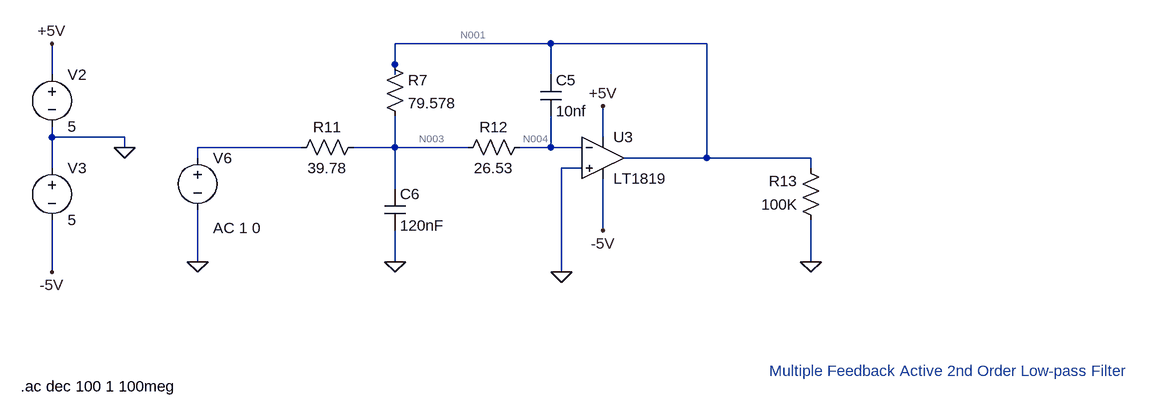
[diagram p0: schematic SecondOrder2.asc]
* SecondOrder2.asc
V2 +5V 0 5
V3 0 -5V 5
* U3: LT1819 (symbol Opamps\LT1819 not available, pins judged from their places): In+=0 In-=N004 V+=+5V V-=-5V OUT=N001
R7 N001 N003 79.578
R11 N003 N002 39.78
R12 N004 N003 26.53
R13 0 N001 100K
C5 N001 N004 10nf
C6 N003 0 120nF
V6 N002 0 AC 1 0
* Multiple Feedback Active 2nd Order Low-pass Filter
.ac dec 100 1 100meg
.backanno
.end

* Results of the author's LTspice run, read from the files saved beside the schematic
* Operating Point, zero values left out:
*   V(+5v) = 5 V
*   V(-5v) = -5 V
*   V(n004) = 3.039 µV
*   V(n001) = -309.2 µV
*   V(n003) = -50.01 µV
*   I(R13) = 3.092 nA
*   I(R12) = 2 µA
*   I(R11) = -1.257 µA
*   I(R7) = -3.257 µA
*   I(V6) = -1.257 µA
*   I(V3) = -8.999 mA
*   I(V2) = -8.999 mA
*   Ix(u3:1) = -2 µA
*   Ix(u3:2) = -2 µA
*   Ix(u3:3) = 3.26 µA
*   Ix(u3:4) = 8.999 mA
*   Ix(u3:5) = -8.999 mA
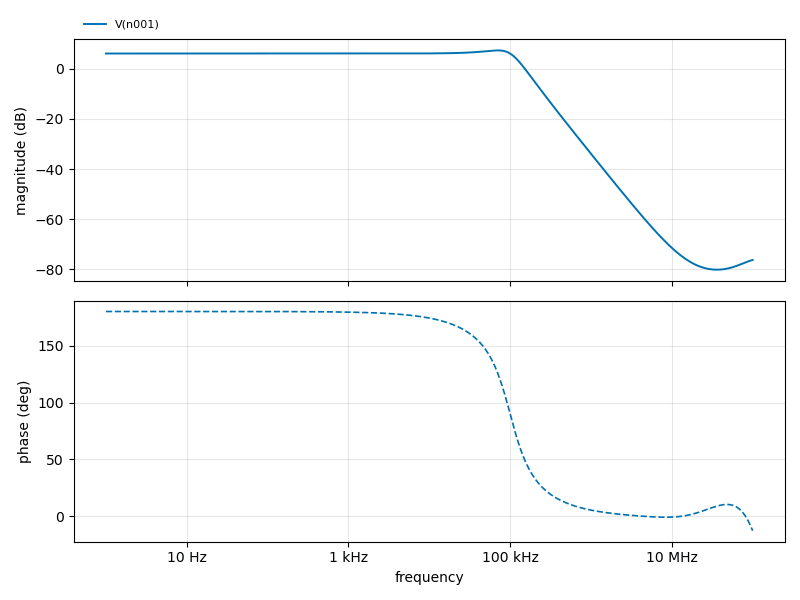
[diagram p1: AC Analysis of SecondOrder2.asc, plotted from the saved traces]
* AC Analysis, 1 run:
*   V(n001): 6.01 dB at 1 Hz, -76.24 dB at 100 MHz, peak 7.25 dB at 70.79 kHz, 3 dB below the peak at 116.8 kHz